# EAGLE design IR_LED_Version2 (EAGLE 7.6.0)
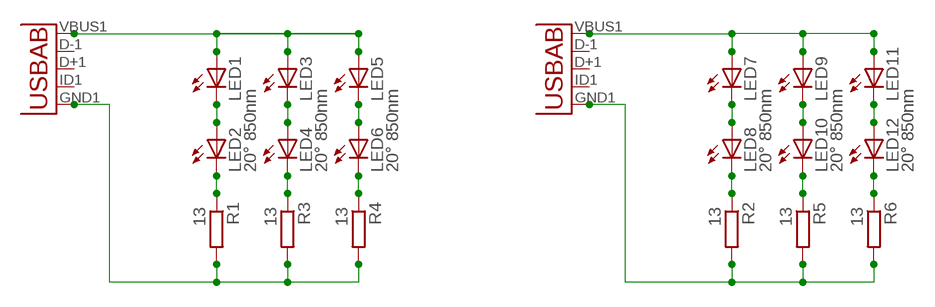
[diagram p0: schematic, sheet 1]

## Parts
LED1  LED5MM  [LED5MM]
LED2  20° 850nm  LED5MM  [LED5MM]
LED3  LED5MM  [LED5MM]
LED4  20° 850nm  LED5MM  [LED5MM]
LED5  LED5MM  [LED5MM]
LED6  20° 850nm  LED5MM  [LED5MM]
LED7  LED5MM  [LED5MM]
LED8  20° 850nm  LED5MM  [LED5MM]
LED9  LED5MM  [LED5MM]
LED10  20° 850nm  LED5MM  [LED5MM]
LED11  LED5MM  [LED5MM]
LED12  20° 850nm  LED5MM  [LED5MM]
R1  13  R-EU_0204/7  [0204/7]
R2  13  R-EU_0204/7  [0204/7]
R3  13  R-EU_0204/7  [0204/7]
R4  13  R-EU_0204/7  [0204/7]
R5  13  R-EU_0204/7  [0204/7]
R6  13  R-EU_0204/7  [0204/7]
U1  USB""  [USB-MICRO-SMD]
U2  USB""  [USB-MICRO-SMD]

## Nets
N$1: LED1.A LED3.A LED5.A U1.VBUS1(VBUS)
N$2: LED1.K(C) LED2.A
N$3: LED3.K(C) LED4.A
N$4: LED5.K(C) LED6.A
N$5: LED2.K(C) R1.1
N$6: R1.2 R3.2 R4.2 U1.GND1(GND)
N$7: LED7.A LED9.A LED11.A U2.VBUS1(VBUS)
N$8: LED7.K(C) LED8.A
N$9: LED9.K(C) LED10.A
N$10: LED11.K(C) LED12.A
N$11: LED4.K(C) R3.1
N$12: R2.2 R5.2 R6.2 U2.GND1(GND)
N$13: LED6.K(C) R4.1
N$15: LED8.K(C) R2.1
N$16: LED10.K(C) R5.1
N$17: LED12.K(C) R6.1
Unconnected: U1.D+1(D+) U1.D-1(D-) U1.ID1(USBID) U2.D+1(D+) U2.D-1(D-) U2.ID1(USBID)

## Library data of the parts
LED1-LED12 = led:LED: LED OSRAM: - CHIPLED LG R971, LG N971, LY N971, LG Q971, LY Q971, LO R971, LY R971 LH N974, LH R974 LS Q976, LO Q976, LY Q976 LO Q996 - Hyper CHIPLED LW Q18S LB Q993, LB Q99A, LB R99A - SideLED LS A670, LO A670, LY A670, LG A670, LP A670 LB A673, LV A673, LT A673, LW A673 LH A674 LY A675 LS A676, LA A676, LO A676, LY A676, LW A676 LS A679, LY A679, LG A679 - Hyper Micro SIDELED® LS Y876, LA Y876, LO Y876, LY Y876 LT Y87S - SmartLED LW L88C, LW L88S LB L89C, LB L89S, LG L890 LS L89K, LO L89K, LY L89K LS L896, LA L896, LO L896, LY L896 - TOPLED LS T670, LO T670, LY T670, LG T670, LP T670 LSG T670, LSP T670, LSY T670, LOP T670, LYG T670 LG T671, LOG T671, LSG T671 LB T673, LV T673, LT T673, LW T673 LH T674 LS T676, LA T676, LO T676, LY T676, LB T676, LH T676, LSB T676, LW T676 LB T67C, LV T67C, LT T67C, LS T67K, LO T67K, LY T67K, LW E67C LS E67B, LA E67B, LO E67B, LY E67B, LB E67C, LV E67C, LT E67C LW T67C LS T679, LY T679, LG T679 LS T770, LO T770, LY T770, LG T770, LP T770 LB T773, LV T773, LT T773, LW T773 LH T774 LS E675, LA E675, LY E675, LS T675 LS T776, LA T776, LO T776, LY T776, LB T776 LHGB T686 LT T68C, LB T68C - Hyper Mini TOPLED® LB M676 - Mini TOPLED Santana® LG M470 LS M47K, LO M47K, LY M47K Source: http://www.osram.convergy.de LUXEON: - LUMILED® LXK2-PW12-R00, LXK2-PW12-S00, LXK2-PW14-U00, LXK2-PW14-V00 LXK2-PM12-R00, LXK2-PM12-S00, LXK2-PM14-U00 LXK2-PE12-Q00, LXK2-PE12-R00, LXK2-PE12-S00, LXK2-PE14-T00, LXK2-PE14-U00 LXK2-PB12-K00, LXK2-PB12-L00, LXK2-PB12-M00, LXK2-PB14-N00, LXK2-PB14-P00, LXK2-PB14-Q00 LXK2-PR12-L00, LXK2-PR12-M00, LXK2-PR14-Q00, LXK2-PR14-R00 LXK2-PD12-Q00, LXK2-PD12-R00, LXK2-PD12-S00 LXK2-PH12-R00, LXK2-PH12-S00 LXK2-PL12-P00, LXK2-PL12-Q00, LXK2-PL12-R00 Source: www.luxeon.com KINGBRIGHT: KA-3528ASYC Source: www.kingbright.com
R1-R6 = rcl:R-EU_: RESISTOR, European symbol
U1 U2 = MicroUSB_mod:USB: This is a USB AB connector that is compatible with USB OTG. i.e. this connector can serve as a host or device

## Net classes
0 default: clearance 0.205 mm

## Board
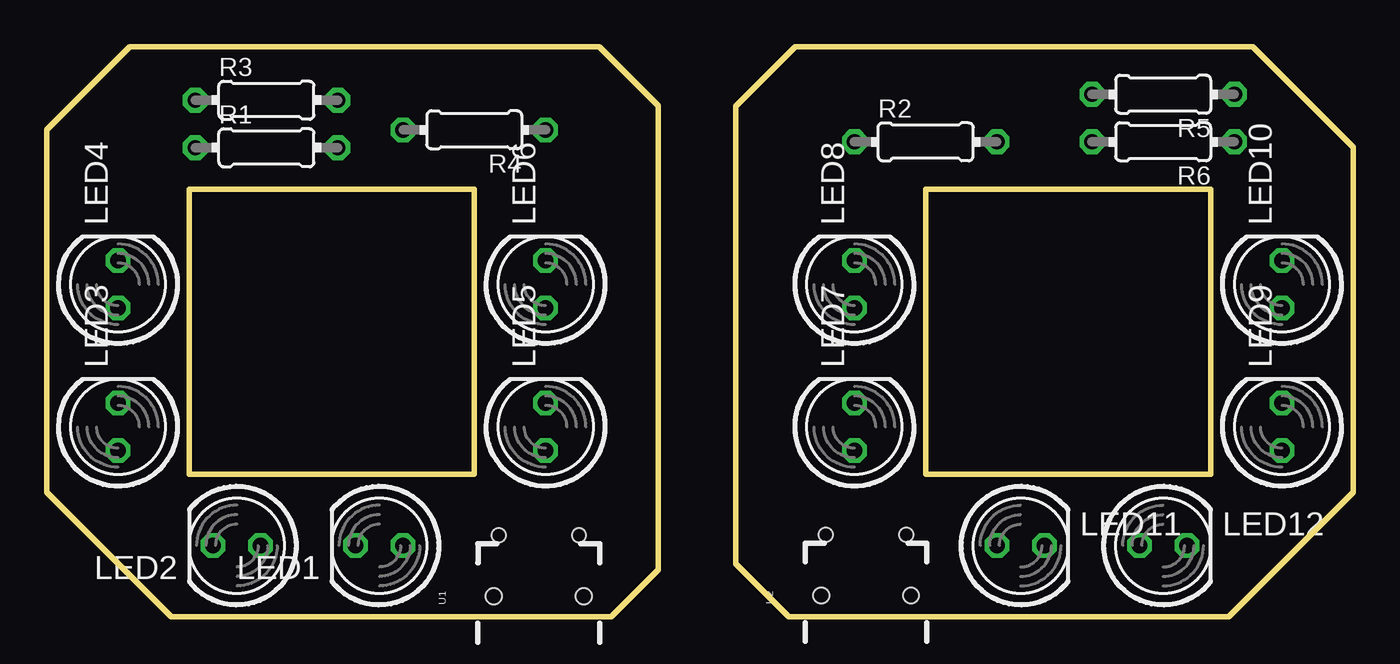
[diagram p1: board, top side]
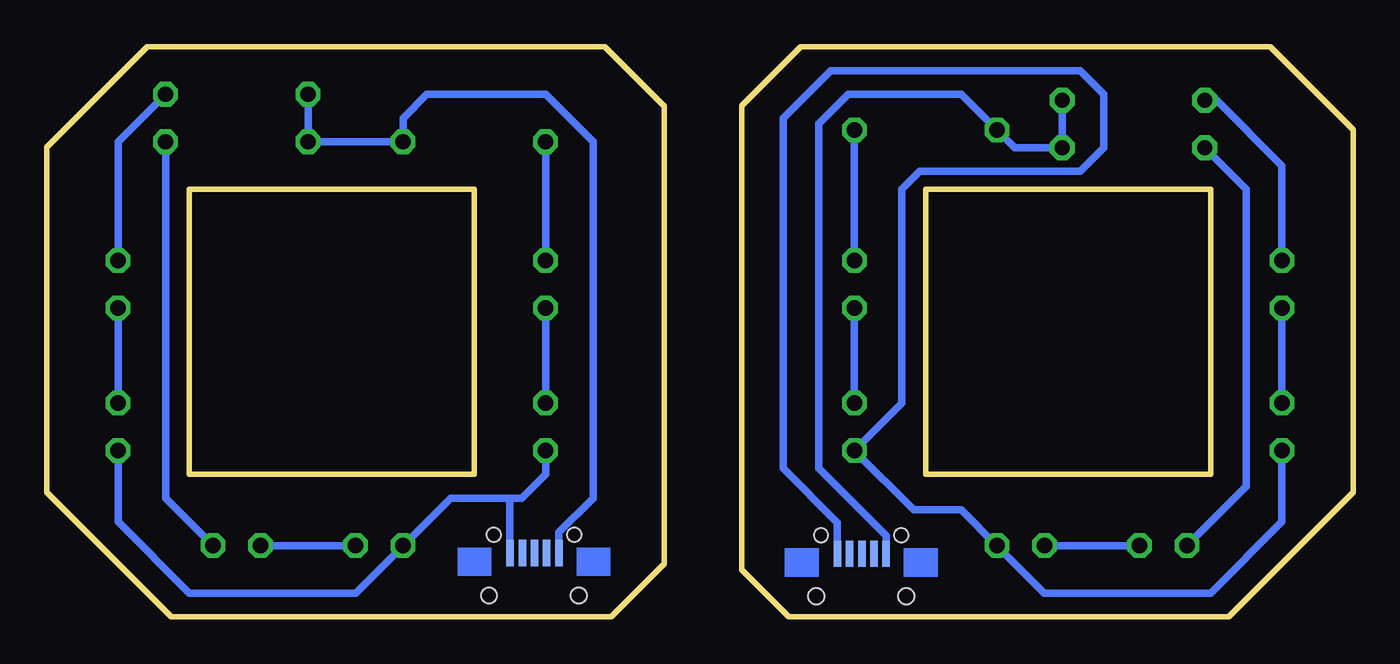
[diagram p2: board, bottom side, seen from below]

Size 69.85 x 30.48 mm. Coordinates in mm from the lower left corner, seen from the top.
Outline: 0,26.04 0,6.65 6.65,0 30.18,0 32.7,2.52 32.7,27.32 29.55,30.48 4.45,30.48 0,26.04
Outline: 22.86,7.62 7.62,7.62 7.62,22.86 22.86,22.86 22.86,7.62
Outline: 46.99,22.86 62.23,22.86 62.23,7.62 46.99,7.62 46.99,22.86
Outline: 69.85,25.1 64.47,30.48 40.01,30.48 36.83,27.3 36.83,2.84 39.67,0 63.2,0 69.85,6.65 69.85,25.1
Copper layers (1*16): Top 0.035mm / dielectric 1.5mm / Bottom 0.035mm
Design rules "default": minimum track width 10mil, minimum drill 24mil, track to track 8mil, track to pad 8mil, pad to pad 8mil, via to via 8mil, smd to smd 8mil, copper to edge 40mil, drill to drill 8mil, minimum pad ring 10mil, minimum via ring 8mil, stop-mask expansion 4mil, vias tented up to drill 0mil, thermal gap 10mil

### Footprints (pad centres in the part's own frame; a part is rotated, then mirrored left to right if it is on the bottom)
LED5MM = drill 0.813 octagon: A -1.27,0; K 1.27,0
0204/7 = drill 0.813 octagon: 1 -3.81,0; 2 3.81,0
USB-MICRO-SMD = smd 1.4 x 0.4 bottom: D+1 1.475,1.03; D-1 1.475,0.38; GND1 1.475,2.33; ID1 1.475,1.68; VBUS1 1.475,-0.27 | hole 0.75: 2.45,3.15; 2.45,-1.15 | hole 0.86: -0.8,-1.4; -0.8,3.4

### Placement (x,y rotation side)
LED1  17.78,3.81 180 top
LED2  10.16,3.81 180 top
LED3  3.81,10.16 90 top
LED4  3.81,17.78 90 top
LED5  26.67,10.16 90 top
LED6  26.67,17.78 90 top
LED7  43.18,10.16 90 top
LED8  43.18,17.78 90 top
LED9  66.04,10.16 90 top
LED10  66.04,17.78 90 top
LED11  52.07,3.81 0 top
LED12  59.69,3.81 0 top
R1  11.75,25.08 0 top
R2  46.99,25.4 0 top
R3  11.75,27.62 0 top
R4  22.86,26.04 180 top
R5  59.69,27.94 180 top
R6  59.69,25.4 180 top
U1  27.3,1.91 90 top
U2  44.81,1.94 90 top

### Tracks (layer width: path | path; a pad name or v marks a point on that pad's centre or on a via)
N$1
  Bottom 0.406: LED3.A 3.81,5.08 7.62,1.27 16.51,1.27 LED1.A 20.96,5.72 23.5,5.72 LED5.A 24.13,11.43 24.13,22.86 23.18,23.81 14.61,23.81 13.34,25.08 13.34,27.94 14.61,29.21 27.94,29.21 30.48,26.67 30.48,7.94 27.57,5.03 U1.VBUS1
N$2
  Bottom 0.406: LED1.K LED2.A
N$3
  Bottom 0.406: LED3.K LED4.A
N$4
  Bottom 0.406: LED5.K LED6.A
N$5
  Bottom 0.406: LED2.K 5.72,6.99 5.72,22.86 R1.1
N$6
  Bottom 0.406: R3.2 R1.2 18.1,25.08 R4.2 20.96,27.94 26.99,27.94 28.57,26.35 28.57,7.94 24.98,4.34 U1.GND1
N$7
  Bottom 0.406: LED9.A 66.04,5.08 62.23,1.27 53.34,1.27 LED11.A 48.26,6.35 45.09,6.35 | 45.09,6.35 44.45,6.35 43.18,7.62 LED7.A | U2.VBUS1 45.09,4.38 45.09,6.35
N$8
  Bottom 0.406: LED7.K LED8.A
N$9
  Bottom 0.406: LED9.K LED10.A
N$10
  Bottom 0.406: LED11.K LED12.A
N$11
  Bottom 0.406: LED4.K 3.81,24.13 7.3,27.62 R3.1
N$12
  Bottom 0.406: R5.2 R6.2 R2.2 50.8,26.67 49.53,27.94 43.18,27.94 40.64,25.4 40.64,6.35 42.48,4.51 U2.GND1
N$13
  Bottom 0.406: LED6.K R4.1
N$15
  Bottom 0.406: LED8.K R2.1
N$16
  Bottom 0.406: LED10.K 66.04,25.4 R5.1
N$17
  Bottom 0.406: LED12.K 63.5,6.35 R6.1